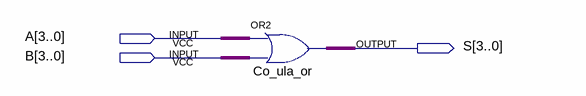
[diagram p0: schematic sheet]
// Quartus schematic or_4co.bdf as structural Verilog: 1 symbols, 3 pins
module or_4co (
  input  [3:0] A,
  input  [3:0] B,
  output [3:0] S
);

  assign S = A | B;  // OR2 Co_ula_or, 4 bits wide
endmodule
